# EasyEDA Pro project MasterCtrl.eprj, board VicePCB
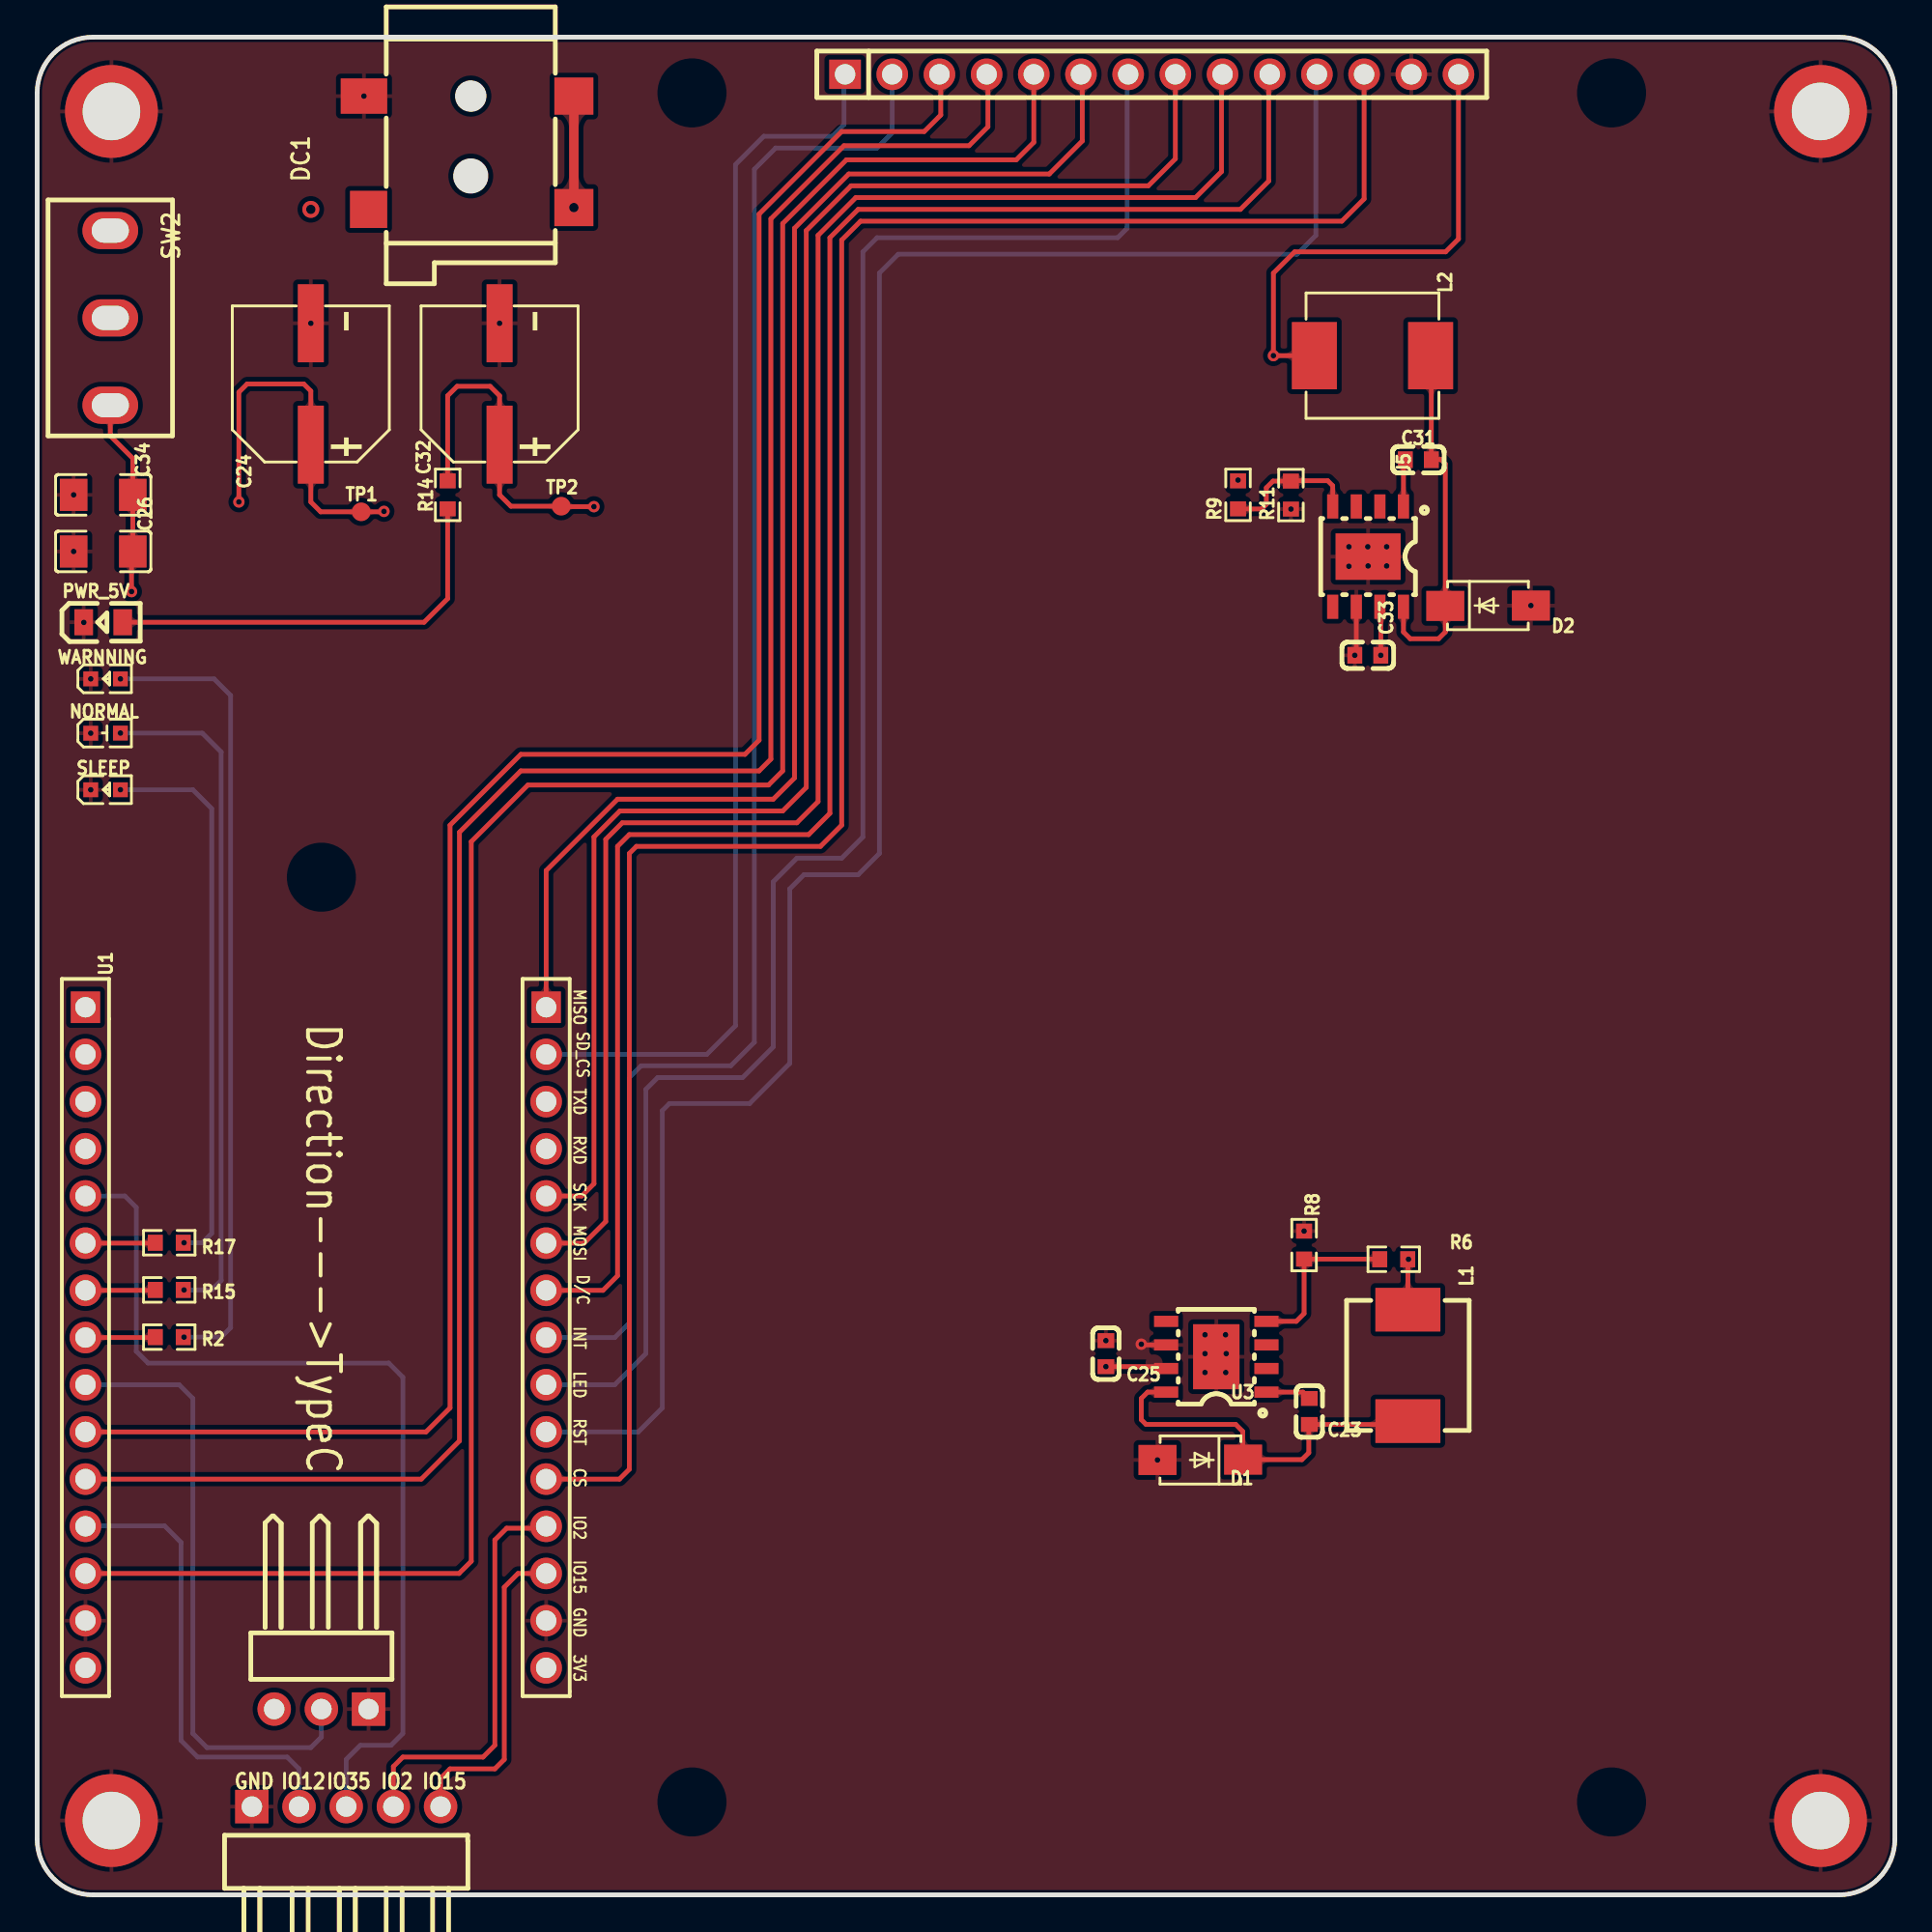
[diagram p6: board, top side]
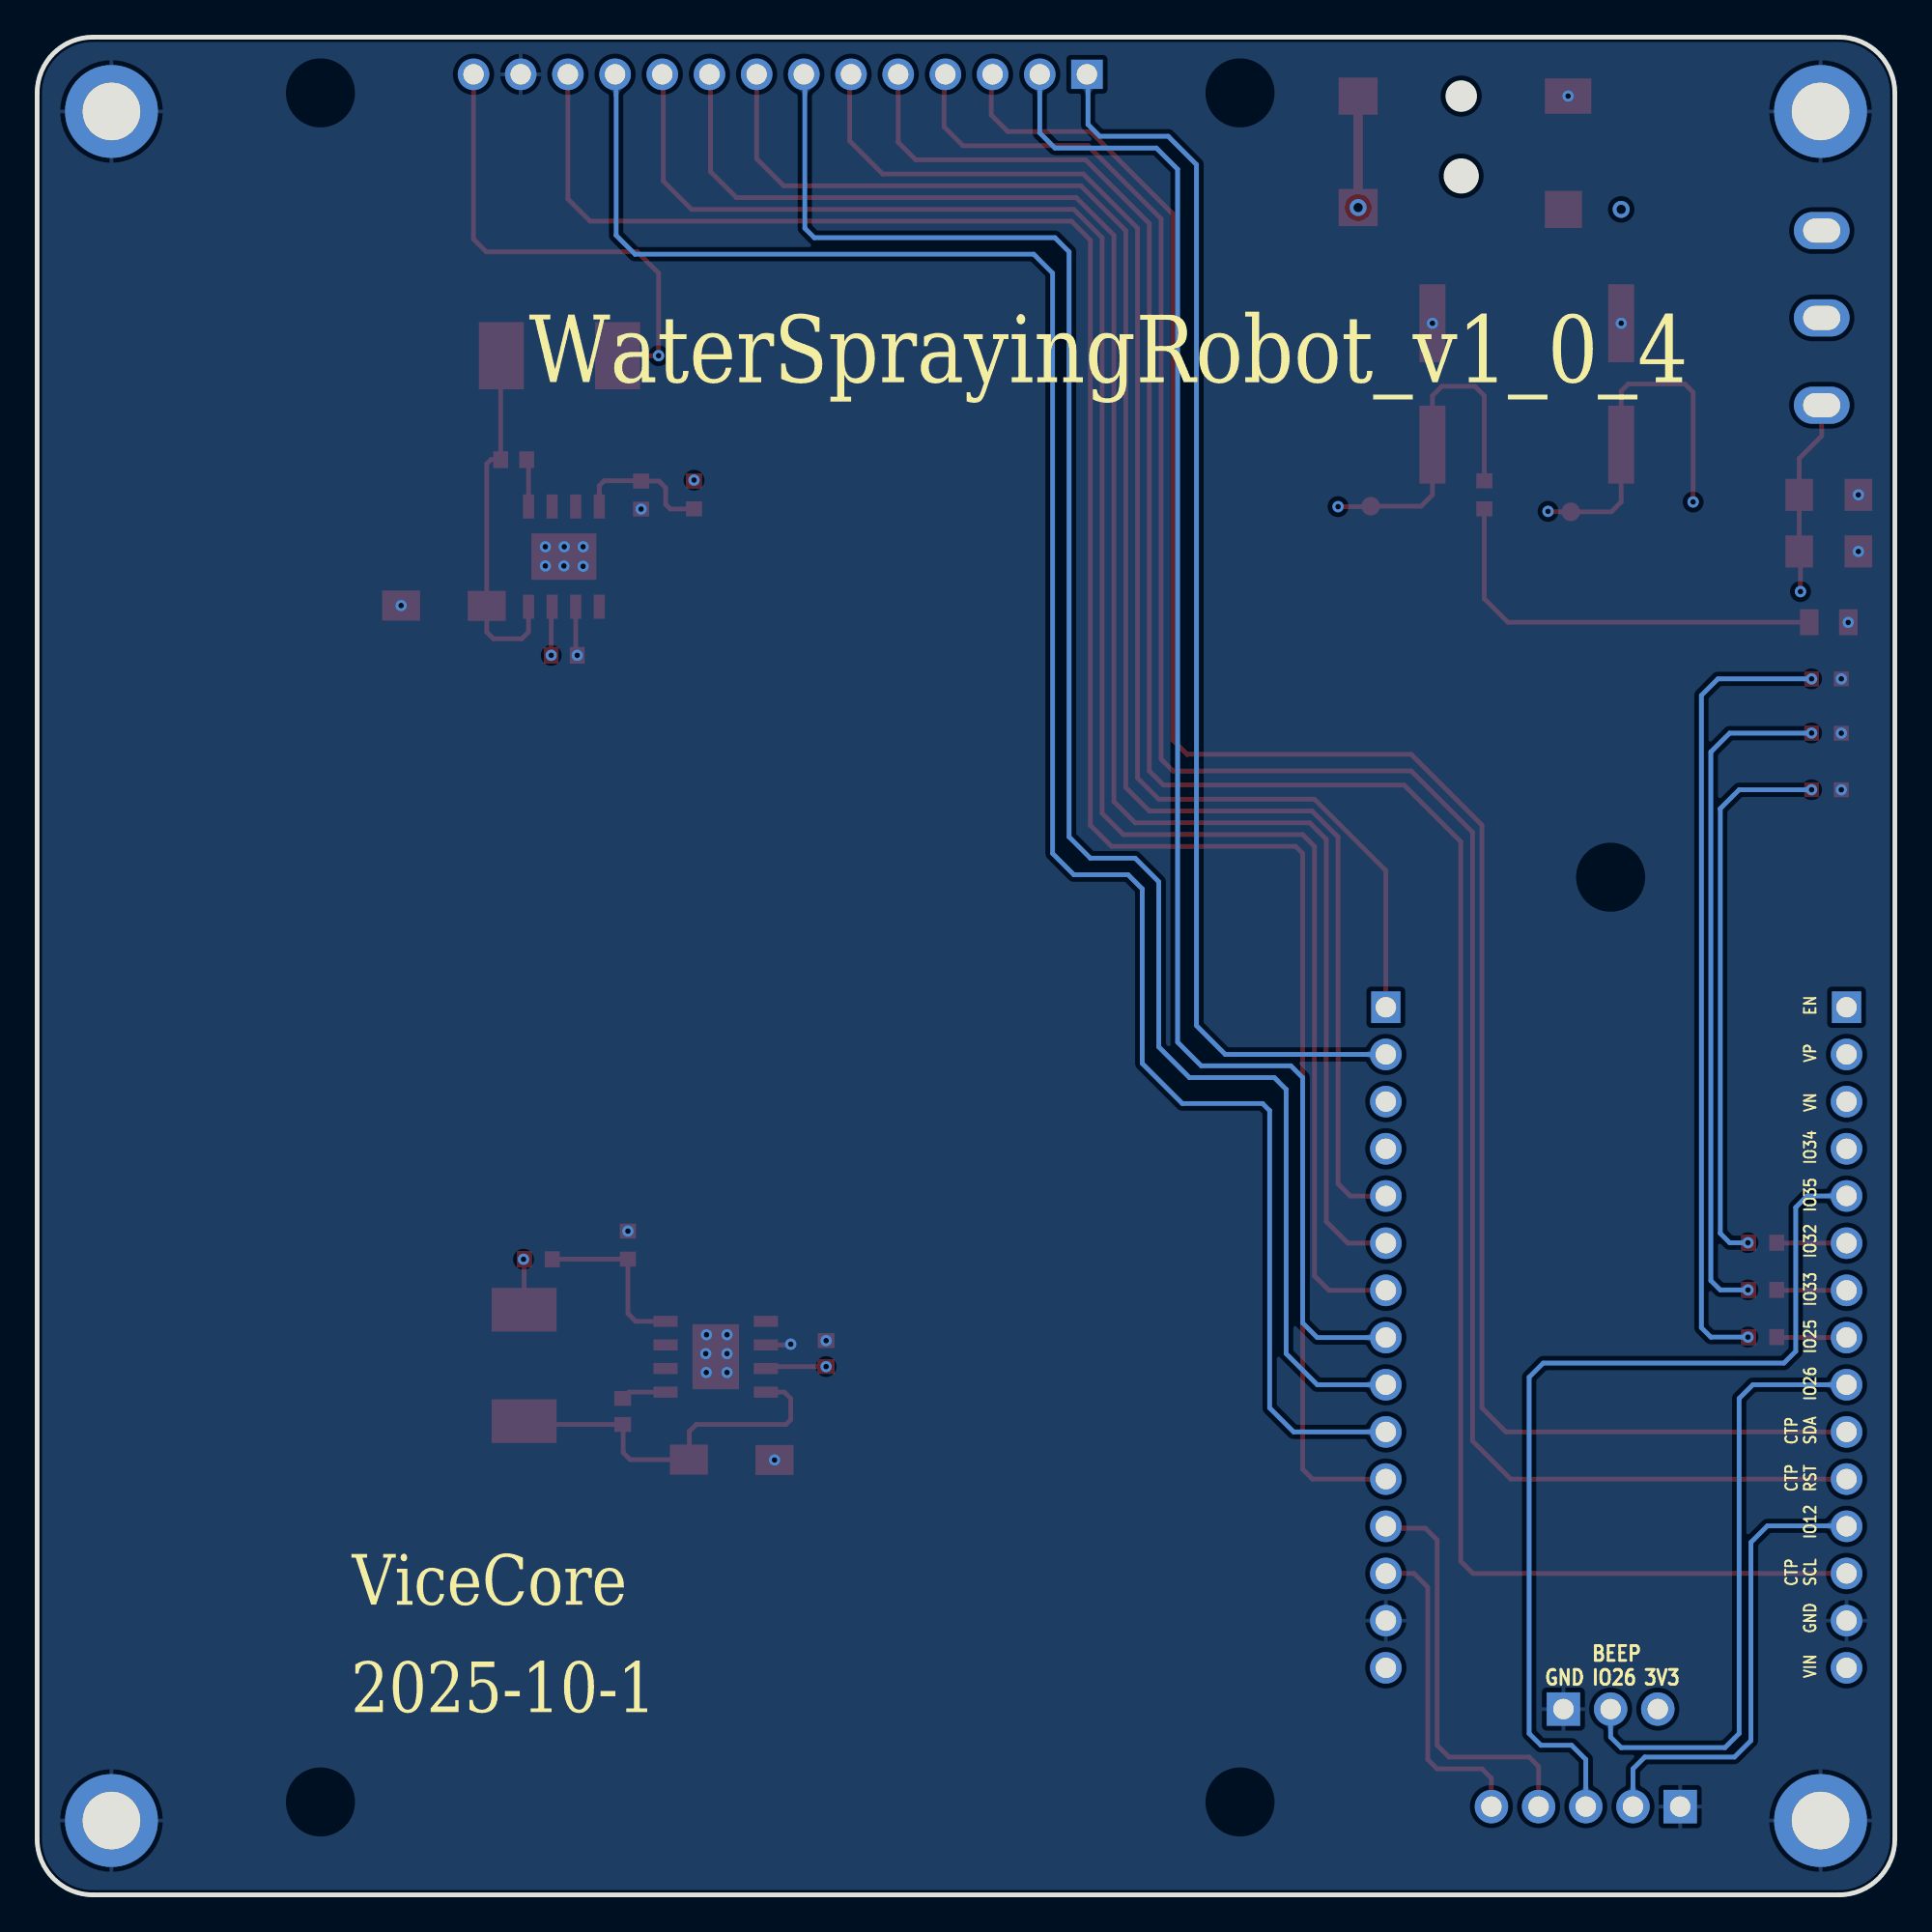
[diagram p7: board, bottom side, seen from below]

Outline 100 x 100 mm; copper layers: Top Layer, GND, PWR, Bottom Layer. Coordinates in mm from the lower left corner of the outline.
Outline path: 0,97 0,3 arc(0.88,0.88) 3,0 97,0 arc(99.12,0.88) 100,3 100,97 arc(99.12,99.12) 97,100 3,100 arc(0.88,99.12) 0,97
Stack: Top Layer 0.035mm 外层铜厚1oz / Dielectric1 0.2104mm 7628 RC49% 8.6mil / GND 0.0152mm 内层铜厚 / Dielectric2 1.065mm 1.1mm H/HOZ Copper / PWR 0.0152mm 内层铜厚 / Dielectric3 0.2104mm 7628 RC49% 8.6mil / Bottom Layer 0.035mm 外层铜厚1oz

## Design rules (mm)
template: JLCPCB Capability(Two Layers Board)
spacing copperThickness1oz (default): track to track 0.102, other pairs 0.152 to 0.3
spacing copperThickness2oz: track to track 0.203, other pairs 0.152 to 0.3
track width copperThickness1oz (default): min 0.127, default 0.254, max 2.54
track width copperThickness2oz: min 0.203, default 0.254, max 2.54
differential pair differentialPair (default): width min 0.127, default 0.254, max 2.54; gap min 0.152, default 0.152
via viaSize (default): diameter min 0.5, default 0.61, max 10; hole min 0.3, default 0.305, max 6.3

## Placement (name value [footprint] x y rotation side)
C23  10nF  [C0603]  68.48 26.02 90 top
C24  220uF  [CAP-SMD_BD8.0-L8.3-W8.3-FD]  14.73 81.33 90 top
C25  100nF  [C0603]  57.53 29.13 90 top
C26  10uF  [C1206]  3.56 72.31 0 top
C31  10nF  [C0603]  74.35 77.25 180 top
C32  220uF  [CAP-SMD_BD8.0-L8.3-W8.3-FD]  24.89 81.33 90 top
C33  100nF  [C0603]  71.63 66.73 180 top
C34  10uF  [C1206]  3.56 75.36 0 top
D1  SS54  [SMA_L4.3-W2.6-LS5.0-FD]  62.61 23.42 0 top
D2  SS54  [SMA_L4.3-W2.6-LS5.0-FD]  78.1 69.39 180 top
DC1  DC050-T  [DC-IN_DC050-T]  23.24 93.78 270 top
H1  PZ254R-11-03P  [HDR-TH_3P-P2.54-H-M-W10.4]  15.3 10 180 top
H2  PZ254R-11-05P  [HDR-TH_5P-P2.54-H-M-W10.4]  16.64 4.75 0 top
L1  10uH  [IND-SMD_L7.3-W6.8]  73.79 28.5 270 top
L2  15uH  [IND-SMD_L7.0-W6.6_FXL0630]  71.88 82.86 180 top
NOREF  -  [Pad_e25]  4 96 0 top
NOREF#2  -  [Pad_e30]  96 4 0 top
NOREF#3  -  [Pad_e31]  96 96 0 top
NOREF#4  -  [Pad_e29]  4 4 0 top
NORMAL  NCD0603G1  [LED0603-RD_1]  3.68 62.53 0 top
PWR_5V  SZYY0805R  [LED0805-R-RD]  3.56 68.5 0 top
R2  510  [R0603]  7.11 30.02 0 top
R6  10K  [R0603]  73.03 34.21 0 top
R8  5.9kΩ  [R0603]  68.2 34.98 270 top
R9  10K  [R0603]  64.64 75.36 90 top
R11  3.24kΩ  [R0603]  67.49 75.35 90 top
R14  1K  [R0603]  22.1 75.36 90 top
R15  510  [R0603]  7.11 32.56 0 top
R17  510  [R0603]  7.11 35.1 0 top
SLEEP  MHT192WDT-ICE  [LED0603-RD]  3.68 59.49 0 top
SW2  SS-12D10L5  [SW-TH_SS-12D10L5]  3.94 84.89 270 top
TP1  -  [Test-Point-0.5mm]  17.45 74.45 0 top
TP2  -  [Test-Point-0.5mm]  28.21 74.75 270 top
U1  ZX-PM2.54-1-15PY  [HDR-TH_15P-P2.54-V-F]  2.6 30 270 top
U2  ZX-PM2.54-1-15PY  [HDR-TH_15P-P2.54-V-F]  27.4 30 270 top
U3  TPS5430DDAR  [ESOP-8_L4.9-W3.9-P1.27-LS6.0-TL-EP]  63.47 28.97 180 top
U5  TPS5430DDAR  [ESOP-8_L4.9-W3.9-P1.27-LS6.0-TL-EP]  71.64 72.04 270 top
U25  PM254-1-14-Z-8.5  [HDR-TH_14P-P2.54-V-F-1]  60 98 0 top
WARNNING  NCD0603Y2  [LED0603-RD]  3.68 65.46 0 top

## Footprints (pads in the part's own frame, mm; a bottom-side part is the same pattern mirrored in y, then rotated)
C0603
  rect 0.8x0.9 smd: 1(-0.7,0) 2(0.7,0)
C1206
  rect 1.485x1.728 smd: 1(-1.593,0) 2(1.593,0)
CAP-SMD_BD8.0-L8.3-W8.3-FD
  rect 4.2x1.4 smd: 1(-3.267,0) 2(3.267,0)
DC-IN_DC050-T
  rect 2x2.1 smd: 1(-3.05,5.65) 1(2.95,5.65)
  rect 1.9x2.5 smd: 2(-3.05,-5.65)
  rect 2x2 smd: 3(3.05,-5.4)
ESOP-8_L4.9-W3.9-P1.27-LS6.0-TL-EP
  rect 1.3x0.6 smd: 1(-2.7,1.905) 2(-2.7,0.635) 3(-2.7,-0.635) 4(-2.7,-1.905) 5(2.7,-1.905) 6(2.7,-0.635) 7(2.7,0.635) 8(2.7,1.905)
  rect 2.5x3.5 smd: 9(0,0)
HDR-TH_3P-P2.54-H-M-W10.4
  rect 1.8x1.8 hole 1.1: 1(-2.54,0)
  round 1.8 hole 1.1: 2(0,0) 3(2.54,0)
HDR-TH_5P-P2.54-H-M-W10.4
  rect 1.8x1.8 hole 1.1: 1(-5.08,0)
  round 1.8 hole 1.1: 2(-2.54,0) 3(0,0) 4(2.54,0) 5(5.08,0)
HDR-TH_14P-P2.54-V-F-1
  rect 1.7x1.575 hole 1.1: 1(-16.51,0)
  round 1.7 hole 1.1: 2(-13.97,0) 3(-11.43,0) 4(-8.89,0) 5(-6.35,0) 6(-3.81,0) 7(-1.27,0) 8(1.27,0) 9(3.81,0) 10(6.35,0) 11(8.89,0) 12(11.43,0) 13(13.97,0) 14(16.51,0)
HDR-TH_15P-P2.54-V-F
  rect 1.7x1.575 hole 1.1: 1(-17.78,0)
  round 1.7 hole 1.1: 2(-15.24,0) 3(-12.7,0) 4(-10.16,0) 5(-7.62,0) 6(-5.08,0) 7(-2.54,0) 8(0,0) 9(2.54,0) 10(5.08,0) 11(7.62,0) 12(10.16,0) 13(12.7,0) 14(15.24,0) 15(17.78,0)
IND-SMD_L7.0-W6.6_FXL0630
  rect 2.424x3.62 smd: 1(3.128,0) 2(-3.128,0)
IND-SMD_L7.3-W6.8
  rect 2.35x3.5 smd: 1(-3,0) 2(3,0)
LED0603-RD
  rect 0.8x0.8 smd: 1(-0.799,0) 2(0.799,0)
LED0603-RD_1
  rect 0.8x0.8 smd: 1(-0.799,-0.004) 2(0.799,0.004)
LED0805-R-RD
  rect 1x1.399 smd: 1(1.05,0) 2(-1.05,0)
Pad_e25
  round 5 hole 3.1: 1(0,0)
Pad_e29
  round 5 hole 3.1: 1(0,0)
Pad_e30
  round 5 hole 3.1: 1(0,0)
Pad_e31
  round 5 hole 3.1: 1(0,0)
R0603
  rect 0.806x0.864 smd: 1(-0.753,0) 2(0.753,0)
SMA_L4.3-W2.6-LS5.0-FD
  rect 2.046x1.62 smd: 1(-2.304,-0.009) 2(2.304,0.009)
SW-TH_SS-12D10L5
  oval 2x3 hole 1.3x2: 1(-4.7,0) 2(0,0) 3(4.7,0)
Test-Point-0.5mm
  round 1 smd: 1(0,0)

## Nets
As in the schematic, except:
GND: C24.2 C25.2 C26.1 C32.2 C33.2 C34.1 D1.1 D2.1 DC1.2 H1.1 H2.1 NOREF.1 NOREF#2.1 NOREF#3.1 NOREF#4.1 NORMAL.1 PWR_5V.2 R8.1 R11.1 SLEEP.1 U1.14 U2.14 U3.6 U3.9 U5.6 U5.9 U25.13 WARNNING.1

Pads without a net: DC1 3; SW2 1; U3 2 3 5; U5 2 3 5

## Via types
v1: diameter 0.61, hole 0.305, Top Layer to Bottom Layer, 43 vias
v2: diameter 0.914, hole 0.508, Top Layer to Bottom Layer, 2 vias

## Routing (per net, layer and track width the routed paths; a pad name or vN(x,y) marks a point on that pad's centre or on a via; arc(x,y) is an arc through that point)
3V3_IN: length 258.2
  Top Layer w0.254: v1(10.86,74.98) 10.86,80.89 11.3,81.33 14.35,81.33 14.73,80.95 C24.1 14.73,74.98 15.26,74.45 TP1.1 18.64,74.45 v1(18.67,74.47) ; L1.1 73.79,34.21 R6.2
  PWR w0.254: U2.15 27.43,12.19 27.43,8.69 26.67,7.93 13.21,7.93 12.76,8.37 H1.3 12.72,9.96 7.11,9.96 6.35,10.72 6.35,49.33 5.84,49.83 4.19,49.83 3.68,50.34 3.68,70.54 4.19,71.04 10.41,71.04 10.86,71.49 v1(10.86,74.98) ; v1(73.82,34.21) 73.82,35.14 74.29,35.61 81.66,35.61 82.93,36.88 82.93,85.39 81.28,87.05 60.83,87.05 60.07,86.28 60.07,77.9 59.44,77.27 27.69,77.27 26.92,76.5 26.92,75.11 26.29,74.47 v1(18.67,74.47)
5V_IN: length 88.8
  Top Layer w0.254: U25.14 76.51,89.13 75.82,88.44 67.69,88.44 66.55,87.3 v1(66.55,82.86) L2.1 ; v1(29.97,74.73) 28.23,74.73 TP2.1 25.5,74.75 24.89,75.36 C32.1 24.89,80.7 24.38,81.2 22.61,81.2 22.1,80.7 R14.2
  PWR w0.254: v1(66.55,82.86) 65.15,82.86 64.64,82.35 v1(64.64,76.16) 31.15,76.16 30.86,75.87 30.86,74.98 30.61,74.73 v1(29.97,74.73)
24V: length 150.6
  Top Layer w0.254: SW2.3 3.94,78.54 5.15,77.33 C34.2 C26.2 5.08,72.25 v1(5.08,70.16) ; v1(57.53,28.43) 60.67,28.43 U3.7 ; v1(72.33,66.73) 72.33,69.29 U5.7
  PWR w0.254: v1(5.08,70.16) 5.08,67.61 6.22,66.47 32.64,66.47 34.54,64.57 34.54,30.4 36.51,28.43 v1(57.53,28.43) ; 34.55,61.01 71.25,61.01 72.33,62.09 v1(72.33,66.73)
GND: length 4
  Top Layer w0.254: U3.6 59.48,29.6 v1(59.44,29.64) ; v1(70.93,66.73) 71.01,66.81 U5.6
  vias: v1(1.96,75.36) v1(1.96,72.31) v1(2.51,68.49) v1(2.88,65.46) v1(2.88,62.53) v1(2.88,59.49) v1(14.73,84.6) v1(17.59,96.83) v1(24.89,84.6) v1(57.53,29.83) v1(60.31,23.41) v1(62.87,30.15) v1(62.87,29.13) v1(62.87,28.12) v1(63.97,30.15) v1(64.01,29.13) v1(63.98,28.12) v1(67.49,74.6) v1(68.2,35.73) v1(70.61,72.57) v1(70.61,71.52) v1(71.63,72.57) v1(71.64,71.53) v1(72.64,72.57) v1(72.64,71.53) v1(80.41,69.4)
VIN_24V: length 35.3
  Top Layer w0.508: v2(28.89,90.83) DC1.1
  PWR w0.508: SW2.2 7.49,84.89 8.64,86.03 8.64,89.2 10.16,90.73 v2(14.73,90.73) 28.79,90.73 v2(28.89,90.83)
BEEP: length 33.1
  Bottom Layer w0.254: U1.9 7.64,27.46 8.38,26.72 8.38,8.69 9.14,7.93 14.73,7.93 15.3,8.49 H1.2
BLUE: length 3.8
  Top Layer w0.254: U1.6 6.34,35.08 R17.1
CTP_INT: length 83.9
  Bottom Layer w0.254: U2.8 31.09,30 31.88,30.78 31.88,43.99 32.51,44.63 37.34,44.63 38.61,45.9 38.61,92.89 39.75,94.03 45.21,94.03 46.03,94.85 U25.2
CTP_RST: length 117.8
  Top Layer w0.254: U25.4 51.18,97.93 51.18,95.17 50.16,94.16 43.43,94.16 39.5,90.22 39.5,61.14 38.86,60.5 26.03,60.5 22.73,57.2 22.73,24.44 20.68,22.38 U1.11
CTP_SCL: length 126.6
  Top Layer w0.254: U25.5 53.65,94.34 52.71,93.4 43.56,93.4 40.13,89.97 40.13,60.5 39.37,59.74 26.42,59.74 23.37,56.69 23.37,17.96 22.71,17.3 U1.13
CTP_SDA: length 112.6
  Top Layer w0.254: U1.10 20.93,24.92 22.22,26.21 22.22,57.58 26.03,61.39 38.1,61.39 38.86,62.15 38.86,90.47 43.31,94.92 47.75,94.92 48.64,95.81 48.64,97.93 U25.3
GREEN: length 3.8
  Top Layer w0.254: U1.7 6.34,32.54 R15.1
IO2: length 22.2
  Top Layer w0.254: U2.12 27.3,19.74 25.27,19.74 24.64,19.1 24.64,8.05 24,7.42 19.69,7.42 19.18,6.91 H2.4
IO12: length 25.2
  Bottom Layer w0.254: H2.2 14.1,6.78 13.46,7.42 8.64,7.42 7.75,8.31 7.75,18.97 6.86,19.86 2.62,19.86 U1.12
IO15: length 17.2
  Top Layer w0.254: H2.5 21.72,6.27 22.22,6.78 24.64,6.78 25.15,7.29 25.15,16.56 25.89,17.3 U2.13
IO35: length 51
  Bottom Layer w0.254: H2.3 16.64,7.29 17.4,8.05 19.05,8.05 19.69,8.69 19.69,27.86 18.92,28.63 5.97,28.63 5.33,29.26 5.33,37.01 4.72,37.62 U1.5
LCD_CS: length 117.1
  Top Layer w0.254: U2.11 31.35,22.38 31.88,22.91 31.88,56.06 32.26,56.44 42.16,56.44 43.31,57.58 43.31,89.08 44.32,90.09 70.23,90.09 71.43,91.29 U25.12
LCD_RS: length 101.1
  Top Layer w0.254: U2.7 30.46,32.54 31.24,33.33 31.24,56.44 31.88,57.07 41.53,57.07 42.67,58.22 42.67,89.2 44.2,90.73 64.77,90.73 66.29,92.25 66.29,97.94 U25.10
LCD_RST: length 110
  Bottom Layer w0.254: U2.10 32.36,24.92 33.66,26.21 33.66,42.22 34.04,42.6 38.35,42.6 40.51,44.75 40.51,54.15 41.28,54.92 44.2,54.92 45.34,56.06 45.34,87.3 46.35,88.32 67.82,88.32 68.83,89.33 68.83,97.94 U25.11
LED: length 97.4
  Bottom Layer w0.254: U25.7 58.67,97.94 58.67,89.71 58.17,89.2 45.21,89.2 44.45,88.44 44.45,56.95 43.31,55.8 40.89,55.8 39.62,54.53 39.62,45.64 37.97,43.99 33.4,43.99 32.77,43.36 32.77,29.13 31.09,27.46 U2.9
MISO: length 73.4
  Top Layer w0.254: U25.6 56.26,97.93 56.26,94.41 54.48,92.63 43.69,92.63 40.77,89.71 40.77,60.12 39.62,58.98 31.24,58.98 27.4,55.14 U2.1
MOSI: length 95.4
  Top Layer w0.254: U25.9 63.75,97.94 63.75,92.76 62.36,91.36 44.07,91.36 42.04,89.33 42.04,58.85 40.89,57.71 31.5,57.71 30.61,56.82 30.61,36.25 29.44,35.08 U2.6
SCK: length 90
  Top Layer w0.254: U25.8 61.27,93.45 59.82,92 43.81,92 41.4,89.59 41.4,59.61 40.13,58.34 31.37,58.34 29.97,56.95 29.97,38.28 29.31,37.62 U2.5
SD_CS: length 66.6
  Bottom Layer w0.254: U25.1 43.43,97.94 43.43,95.3 42.8,94.67 39.12,94.67 37.59,93.14 37.59,46.79 36.04,45.24 U2.2
VSEN_3V3: length 9.2
  Top Layer w0.254: U3.4 67.78,30.87 68.2,31.29 R8.2 72.26,34.22 R6.1
VSEN_5V: length 7.5
  Top Layer w0.254: R9.1 64.65,74.6 65.91,74.6 66.17,74.85 66.17,75.74 66.53,76.1 R11.2 67.51,76.12 69.47,76.12 69.74,75.85 U5.4
YELLOW: length 3.8
  Top Layer w0.254: U1.8 6.34,30 R2.1
$2N473: length 2.4
  Top Layer w0.254: C23.2 68.14,27.06 U3.1
$2N474: length 20.5
  Top Layer w0.254: L1.2 73.61,25.32 C23.1 68.45,25.29 68.45,23.8 68.08,23.43 D1.2 64.9,23.45 64.9,24.94 64.52,25.32 59.69,25.32 59.44,25.58 59.44,26.72 59.78,27.06 U3.8
$2N1336: length 2.6
  Top Layer w0.254: C31.2 73.55,77.16 U5.1
$2N1337: length 19.4
  Top Layer w0.254: U5.8 73.55,67.98 73.91,67.61 75.44,67.61 75.8,67.98 D2.2 75.8,77.03 75.56,77.27 75.06,77.27 C31.1 75.05,82.82 L2.2
$2N5426: length 22.9
  Top Layer w0.254: R14.1 22.1,69.77 20.83,68.5 PWR_5V.1
$2N6328: length 43.1
  Bottom Layer w0.254: v1(7.91,30.02) 9.91,30.02 10.41,30.53 10.41,64.57 9.53,65.46 v1(4.48,65.46)
$2N6354: length 36.5
  Bottom Layer w0.254: v1(7.91,32.56) 9.4,32.56 9.91,33.07 9.91,61.52 8.89,62.53 4.49,62.53 v1(4.48,62.54)
$2N6406: length 29.9
  Bottom Layer w0.254: v1(4.48,59.49) 4.49,59.49 8.38,59.49 9.4,58.47 9.4,35.61 8.89,35.1 v1(7.91,35.1)

## Copper pours and planes (outline as drawn; the poured copper is in the pictures)
GND on Top Layer: -13.84,111.43 116.21,111.43 116.21,-14.68 -13.84,-14.68
GND on Bottom Layer: -15.75,110.8 115.57,110.8 115.57,-13.79 -15.75,-13.79
GND on GND: -19.94,115.75 115.95,115.75 115.95,-22.05 -19.94,-22.05

Small or netless copper shapes (teardrops, artwork), in the pictures only: 91 on Top Layer, 20 on Bottom Layer, 18 on PWR

## Text on the board
Bottom Silkscreen Layer: EN | VP | VN | IO34 | IO35 | IO32 | IO33 | IO25 | IO26 | CTP / SDA | CTP / RST | IO12 | CTP / SCL | GND | VIN | 3V3 | BEEP / IO26 | ViceCore | 2025-10-1 | WaterSprayingRobot_v1_0_4
Top Silkscreen Layer: MISO | TXD | RXD | SCK | MOSI | INT | LED | RST | CS | IO2 | IO15 | GND | 3V3 | SD_CS | D/C | IO12 | IO35 | Direction--->TypeC
